# EAGLE design tusb8041_hub_test (EAGLE 6.4)

## Sheet 1 of 6: Board Power
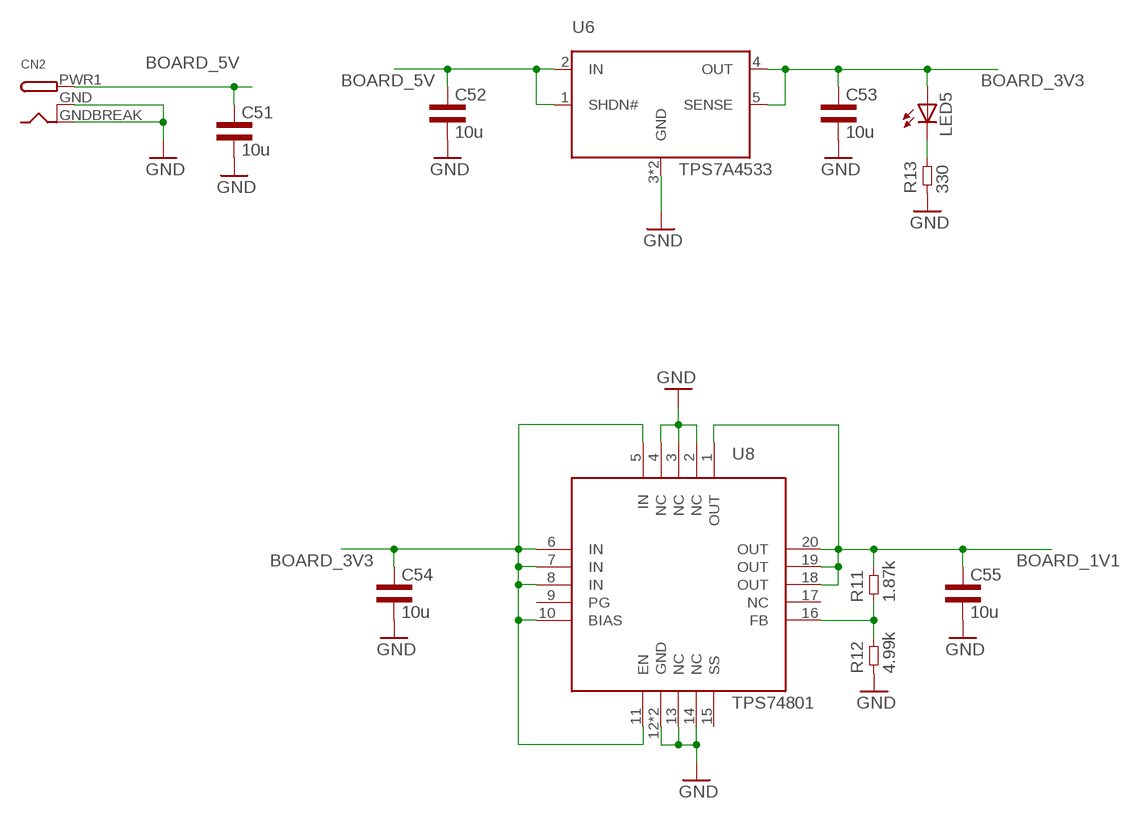
[diagram p0: schematic, sheet 1]

### Parts
C51  10u  CAP1206L3  [1206L3]
C52  10u  CAP1206L3  [1206L3]
C53  10u  CAP1206L3  [1206L3]
C54  10u  CAP1206L3  [1206L3]
C55  10u  CAP1206L3  [1206L3]
CN2  DCBARRELSMT  [DCJACK_2MM_SMT]
LED5  LEDCHIP-LED0603  [CHIP-LED0603]
R11  1.87k  RES0402L3  [0402L3]
R12  4.99k  RES0402L3  [0402L3]
R13  330  RES0603L3  [0603L3]
U6  TPS7A4533  [R-PSFM-G5]
U8  TPS74801  [S-PVQFN-N20]

### Nets
BOARD_1V1: C55.1 R11.P$2 U8.1(OUT) U8.18(OUT) U8.19(OUT) U8.20(OUT) ; also sheet 3
BOARD_3V3: C53.1 C54.1 LED5.A U6.4(OUT) U6.5(SENSE) U8.5(IN) U8.6(IN) U8.7(IN) U8.8(IN) U8.10(BIAS) U8.11(EN) ; also sheet 3
BOARD_5V: C51.1 C52.1 CN2.PWR1(PWR) U6.1(SHDN#) U6.2(IN) ; also sheet 2
GND: C51.2 C52.2 C53.2 C54.2 C55.2 CN2.GND(GNDBREAK) CN2.GNDBREAK(GND) R12.P$1 R13.P$1 U6.3(GND) U6.TP(GND) U8.2(NC) U8.3(NC) U8.4(NC) U8.12(GND) U8.13(NC) U8.14(NC) U8.TP(GND) ; also sheet 2,3,4,5,6
N$13: LED5.C R13.P$2
N$15: R11.P$1 R12.P$2 U8.16(FB)
Unconnected: U8.9(PG) U8.15(SS) U8.17(NC)

## Sheet 2 of 6: Down PWR
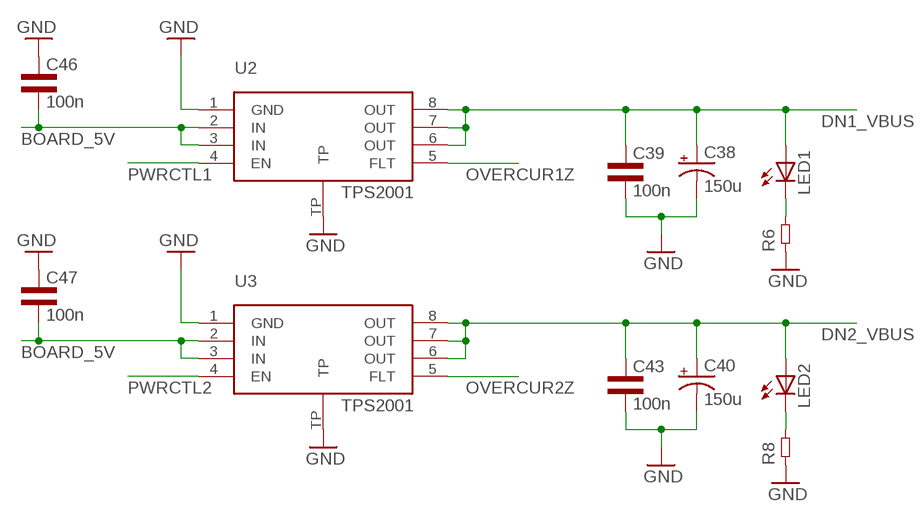
[diagram p1: schematic, sheet 2]

### Parts
C38  150u  CPOL-USCT7343  [CT7343]
C39  100n  CAP0603L3  [0603L3]
C40  150u  CPOL-USCT7343  [CT7343]
C43  100n  CAP0603L3  [0603L3]
C46  100n  CAP0603L3  [0603L3]
C47  100n  CAP0603L3  [0603L3]
LED1  LEDCHIP-LED0603  [CHIP-LED0603]
LED2  LEDCHIP-LED0603  [CHIP-LED0603]
R6  RES0603L3  [0603L3]
R8  RES0603L3  [0603L3]
U2  TPS2001  [S-PDSO-G8]
U3  TPS2001  [S-PDSO-G8]

### Nets
BOARD_5V: C46.P$2 C47.P$2 U2.2(IN) U2.3(IN) U3.2(IN) U3.3(IN) ; also sheet 1
DN1_VBUS: C38.+ C39.P$1 LED1.A U2.6(OUT) U2.7(OUT) U2.8(OUT) ; also sheet 5
DN2_VBUS: C40.+ C43.P$1 LED2.A U3.6(OUT) U3.7(OUT) U3.8(OUT) ; also sheet 5
GND: C38.- C39.P$2 C40.- C43.P$2 C46.P$1 C47.P$1 R6.P$1 R8.P$1 U2.1(GND) U2.TP U3.1(GND) U3.TP ; also sheet 1,3,4,5,6
N$1: LED1.C R6.P$2
N$6: LED2.C R8.P$2
OVERCUR1Z: U2.5(FLT) ; also sheet 5
OVERCUR2Z: U3.5(FLT) ; also sheet 5
PWRCTL1: U2.4(EN) ; also sheet 5
PWRCTL2: U3.4(EN) ; also sheet 5

## Sheet 3 of 6: TUSB PWR
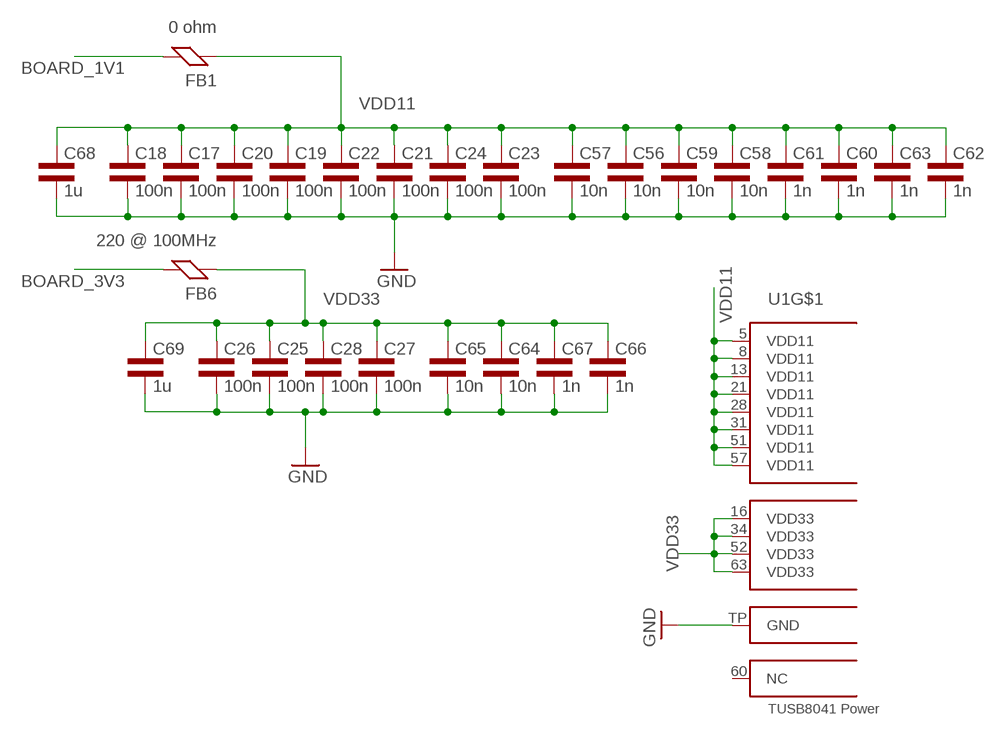
[diagram p2: schematic, sheet 3]

### Parts
C17  100n  CAP0402L3  [0402L3]
C18  100n  CAP0402L3  [0402L3]
C19  100n  CAP0402L3  [0402L3]
C20  100n  CAP0402L3  [0402L3]
C21  100n  CAP0402L3  [0402L3]
C22  100n  CAP0402L3  [0402L3]
C23  100n  CAP0402L3  [0402L3]
C24  100n  CAP0402L3  [0402L3]
C25  100n  CAP0402L3  [0402L3]
C26  100n  CAP0402L3  [0402L3]
C27  100n  CAP0402L3  [0402L3]
C28  100n  CAP0402L3  [0402L3]
C56  10n  CAP0402L3  [0402L3]
C57  10n  CAP0402L3  [0402L3]
C58  10n  CAP0402L3  [0402L3]
C59  10n  CAP0402L3  [0402L3]
C60  1n  CAP0402L3  [0402L3]
C61  1n  CAP0402L3  [0402L3]
C62  1n  CAP0402L3  [0402L3]
C63  1n  CAP0402L3  [0402L3]
C64  10n  CAP0402L3  [0402L3]
C65  10n  CAP0402L3  [0402L3]
C66  1n  CAP0402L3  [0402L3]
C67  1n  CAP0402L3  [0402L3]
C68  1u  CAP0805L3  [0805L3]
C69  1u  CAP0805L3  [0805L3]
FB1  0 ohm  FERRITE0603L3  [0603L3]
FB6  220 @ 100MHz  FERRITE0603L3  [0603L3]
U1  TUSB8041  [VQFN64]

### Nets
BOARD_1V1: FB1.P$2 ; also sheet 1
BOARD_3V3: FB6.P$2 ; also sheet 1
GND: C17.P$2 C18.P$2 C19.P$2 C20.P$2 C21.P$2 C22.P$2 C23.P$2 C24.P$2 C25.P$2 C26.P$2 C27.P$2 C28.P$2 C56.P$2 C57.P$2 C58.P$2 C59.P$2 C60.P$2 C61.P$2 C62.P$2 C63.P$2 C64.P$2 C65.P$2 C66.P$2 C67.P$2 C68.2 C69.2 U1.TP(GND) ; also sheet 1,2,4,5,6
VDD11: C17.P$1 C18.P$1 C19.P$1 C20.P$1 C21.P$1 C22.P$1 C23.P$1 C24.P$1 C56.P$1 C57.P$1 C58.P$1 C59.P$1 C60.P$1 C61.P$1 C62.P$1 C63.P$1 C68.1 FB1.P$1 U1.5(VDD11) U1.8(VDD11) U1.13(VDD11) U1.21(VDD11) U1.28(VDD11) U1.31(VDD11) U1.51(VDD11) U1.57(VDD11)
VDD33: C25.P$1 C26.P$1 C27.P$1 C28.P$1 C64.P$1 C65.P$1 C66.P$1 C67.P$1 C69.1 FB6.P$1 U1.16(VDD33) U1.34(VDD33) U1.52(VDD33) U1.63(VDD33) ; also sheet 5
Unconnected: U1.60(NC)

## Sheet 4 of 6: TUSB US
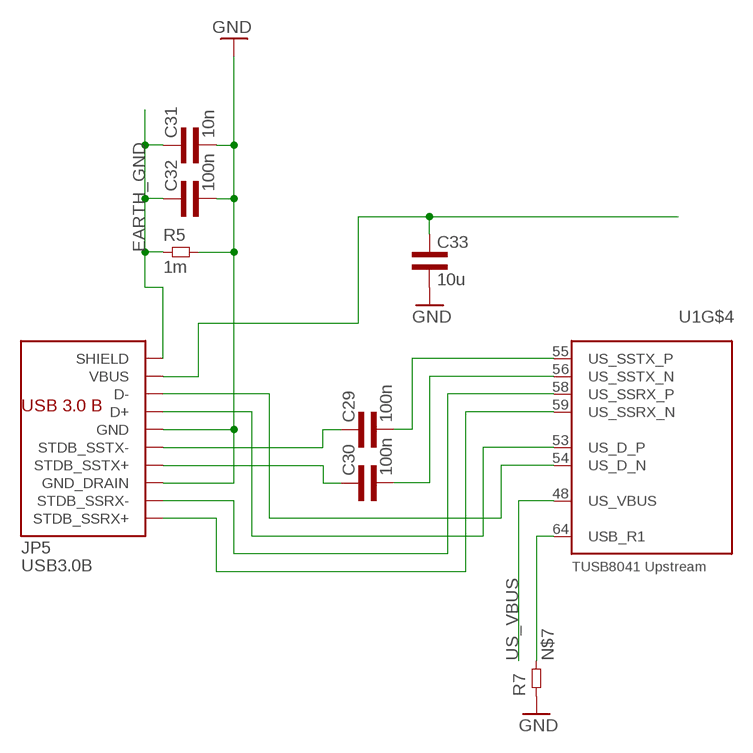
[diagram p3: schematic, sheet 4]

### Parts
C29  100n  CAP0402L3  [0402L3]
C30  100n  CAP0402L3  [0402L3]
C31  10n  CAP0603L3  [0603L3]
C32  100n  CAP0603L3  [0603L3]
C33  10u  CAP1206L3  [1206L3]
JP5  USB3.0B  [AMPHENOLUSB3.0B]
R5  1m  RES0603L3  [0603L3]
R7  RES0402L3  [0402L3]

### Nets
EARTH_GND: C31.P$1 C32.P$1 JP5.10@1(SHIELD) JP5.10@2(SHIELD) R5.P$1 ; also sheet 5
GND: C31.P$2 C32.P$2 C33.2 JP5.4(GND) JP5.7(GND_DRAIN) R5.P$2 R7.P$1 ; also sheet 1,2,3,5,6
N$7: R7.P$2 U1.64(USB_R1)
US_CAP_SSTX_N: C29.P$1 JP5.5(STDB_SSTX-)
US_CAP_SSTX_P: C30.P$1 JP5.6(STDB_SSTX+)
US_D_N: JP5.2(D-) U1.54(US_D_N)
US_D_P: JP5.3(D+) U1.53(US_D_P)
US_SSRX_N: JP5.9(STDB_SSRX+) U1.59(US_SSRX_N)
US_SSRX_P: JP5.8(STDB_SSRX-) U1.58(US_SSRX_P)
US_SSTX_N: C30.P$2 U1.56(US_SSTX_N)
US_SSTX_P: C29.P$2 U1.55(US_SSTX_P)
US_VBUS: C33.1 JP5.1(VBUS) U1.48(US_VBUS)

## Sheet 5 of 6: TUSB DS
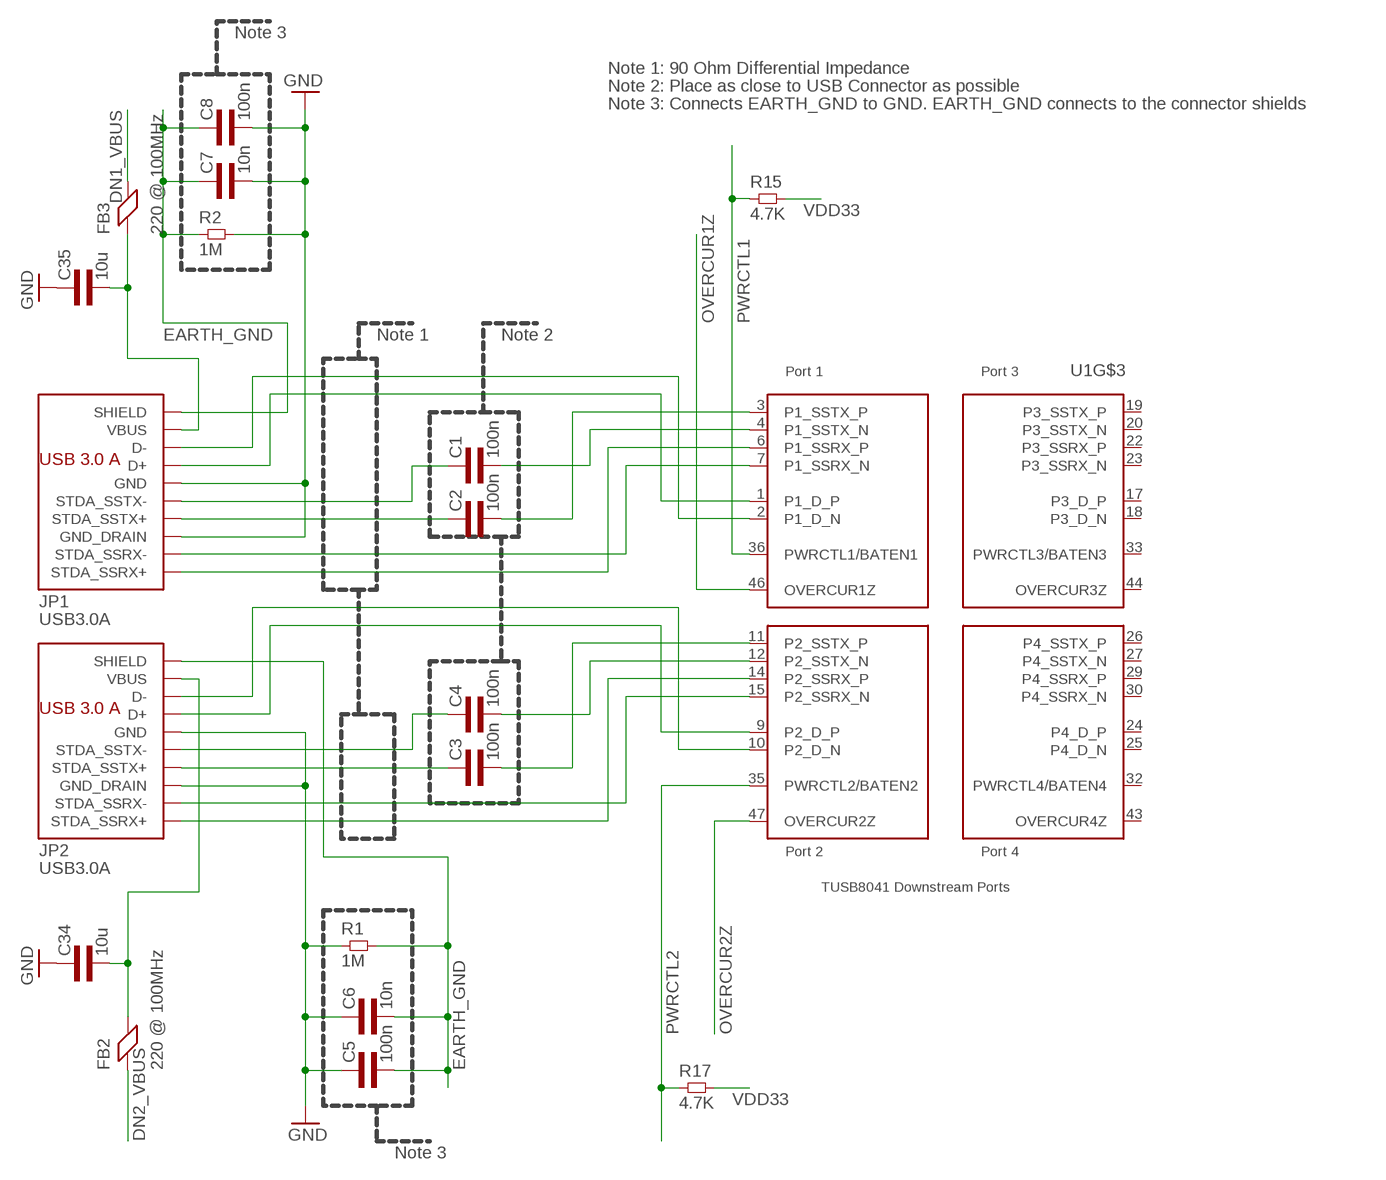
[diagram p4: schematic, sheet 5]

### Parts
C1  100n  CAP0402L3  [0402L3]
C2  100n  CAP0402L3  [0402L3]
C3  100n  CAP0402L3  [0402L3]
C4  100n  CAP0402L3  [0402L3]
C5  100n  CAP0603L3  [0603L3]
C6  10n  CAP0603L3  [0603L3]
C7  10n  CAP0603L3  [0603L3]
C8  100n  CAP0603L3  [0603L3]
C34  10u  CAP1206L3  [1206L3]
C35  10u  CAP1206L3  [1206L3]
FB2  220 @ 100MHz  FERRITE0603L1  [0603L1]
FB3  220 @ 100MHz  FERRITE0603L1  [0603L1]
JP1  USB3.0A  [AMPHENOLUSB3.0A]
JP2  USB3.0A  [AMPHENOLUSB3.0A]
R1  1M  RES0603L3  [0603L3]
R2  1M  RES0603L3  [0603L3]
R15  4.7K  RES0402L3  [0402L3]
R17  4.7K  RES0402L3  [0402L3]

### Nets
DN1_VBUS: FB3.2 ; also sheet 2
DN2_VBUS: FB2.1 ; also sheet 2
EARTH_GND: C5.P$2 C6.P$2 C7.P$1 C8.P$1 JP1.10@1(SHIELD) JP1.10@2(SHIELD) JP2.10@1(SHIELD) JP2.10@2(SHIELD) R1.P$2 R2.P$1 ; also sheet 4
GND: C5.P$1 C6.P$1 C7.P$2 C8.P$2 C34.1 C35.1 JP1.4(GND) JP1.7(GND_DRAIN) JP2.4(GND) JP2.7(GND_DRAIN) R1.P$1 R2.P$2 ; also sheet 1,2,3,4,6
N$2: C35.2 FB3.1 JP1.1(VBUS)
N$3: C34.2 FB2.2 JP2.1(VBUS)
OVERCUR1Z: U1.46(OVERCUR1Z) ; also sheet 2
OVERCUR2Z: U1.47(OVERCUR2Z) ; also sheet 2
P1_CAP_SSTX_N: C1.P$1 JP1.8(STDA_SSTX-)
P1_CAP_SSTX_P: C2.P$1 JP1.9(STDA_SSTX+)
P1_D_N: JP1.2(D-) U1.2(P1_D_N)
P1_D_P: JP1.3(D+) U1.1(P1_D_P)
P1_SSRX_N: JP1.5(STDA_SSRX-) U1.7(P1_SSRX_N)
P1_SSRX_P: JP1.6(STDA_SSRX+) U1.6(P1_SSRX_P)
P1_SSTX_N: C1.P$2 U1.4(P1_SSTX_N)
P1_SSTX_P: C2.P$2 U1.3(P1_SSTX_P)
P2_CAP_SSTX_N: C4.P$1 JP2.8(STDA_SSTX-)
P2_CAP_SSTX_P: C3.P$1 JP2.9(STDA_SSTX+)
P2_D_N: JP2.2(D-) U1.10(P2_D_N)
P2_D_P: JP2.3(D+) U1.9(P2_D_P)
P2_SSRX_N: JP2.5(STDA_SSRX-) U1.15(P2_SSRX_N)
P2_SSRX_P: JP2.6(STDA_SSRX+) U1.14(P2_SSRX_P)
P2_SSTX_N: C4.P$2 U1.12(P2_SSTX_N)
P2_SSTX_P: C3.P$2 U1.11(P2_SSTX_P)
PWRCTL1: R15.P$1 U1.36(PWRCTL1/BATEN1) ; also sheet 2
PWRCTL2: R17.P$1 U1.35(PWRCTL2/BATEN2) ; also sheet 2
VDD33: R15.P$2 R17.P$2 ; also sheet 3
Unconnected: U1.17(P3_D_P) U1.18(P3_D_N) U1.19(P3_SSTX_P) U1.20(P3_SSTX_N) U1.22(P3_SSRX_P) U1.23(P3_SSRX_N) U1.24(P4_D_P) U1.25(P4_D_N) U1.26(P4_SSTX_P) U1.27(P4_SSTX_N) U1.29(P4_SSRX_P) U1.30(P4_SSRX_N) U1.32(PWRCTL4/BATEN4) U1.33(PWRCTL3/BATEN3) U1.43(OVERCUR4Z) U1.44(OVERCUR3Z)

### Notes on the sheet
- Note 3
- Note 1: 90 Ohm Differential Impedance
- Note 2: Place as close to USB Connector as possible
- Note 3: Connects EARTH_GND to GND. EARTH_GND connects to the connector shields
- Note 1 | Note 2
- Note 3

## Sheet 6 of 6: TUSB Misc
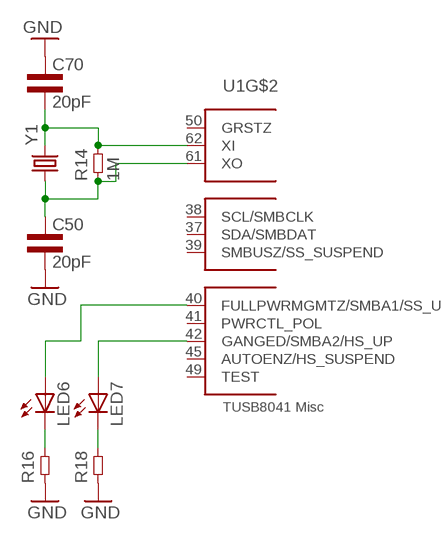
[diagram p5: schematic, sheet 6]

### Parts
C50  20pF  CAP0402L3  [0402L3]
C70  20pF  CAP0402L3  [0402L3]
LED6  LEDCHIPLED_0603  [CHIPLED_0603]
LED7  LEDCHIPLED_0603  [CHIPLED_0603]
R14  1M  RES0402L3  [0402L3]
R16  RES0402L3  [0402L3]
R18  RES0402L3  [0402L3]
Y1  CRYSTALHC49US  [HC49US]

### Nets
CLK_N: C70.P$2 R14.P$2 U1.62(XI) Y1.2
CLK_P: C50.P$1 R14.P$1 U1.61(XO) Y1.1
GND: C50.P$2 C70.P$1 R16.P$1 R18.P$1 ; also sheet 1,2,3,4,5
N$10: LED6.C R16.P$2
N$11: LED7.C R18.P$2
N$12: LED7.A U1.42(GANGED/SMBA2/HS_UP)
N$14: LED6.A U1.40(FULLPWRMGMTZ/SMBA1/SS_UP)
Unconnected: U1.37(SDA/SMBDAT) U1.38(SCL/SMBCLK) U1.39(SMBUSZ/SS_SUSPEND) U1.41(PWRCTL_POL) U1.45(AUTOENZ/HS_SUSPEND) U1.49(TEST) U1.50(GRSTZ)

## Library data of the parts
C1-C8 C17-C35 C39 C43 C46 C47 C50-C70 = common:CAP
C38 C40 = rcl:CPOL-US: POLARIZED CAPACITOR, American symbol
CN2 = adafruit:DCBARREL: 2.0mm DC Barrel Jack DCJACK_2MM_PTH - Through Hole Jack (4UConnector: 05537)
FB1-FB3 FB6 = common:FERRITE
JP1 JP2 = AlexW-Eagle-Libraries:USB3.0A: Usb3.0A Amphenol USB 3.0 A jack
JP5 = AlexW-Eagle-Libraries:USB3.0B: USB3.0B Amphenol USB 3.0 B connector
LED1 LED2 LED5-LED7 = adafruit:LED: LED OSRAM: - CHIPLED LG R971, LG N971, LY N971, LG Q971, LY Q971, LO R971, LY R971 LH N974, LH R974 LS Q976, LO Q976, LY Q976 LO Q996 - Hyper CHIPLED LW Q18S LB Q993, LB Q99A, LB R99A - SideLED LS A670, LO A670, LY A670, LG A670, LP A670 LB A673, LV A673, LT A673, LW A673 LH A674 LY A675 LS A676, LA A676, LO A676, LY A676, LW A676 LS A679, LY A679, LG A679 - Hyper Micro SIDELED® LS Y876, LA Y876, LO Y876, LY Y876 LT Y87S - SmartLED LW L88C, LW L88S LB L89C, LB L89S, LG L890 LS L89K, LO L89K, LY L89K LS L896, LA L896, LO L896, LY L896 - TOPLED LS T670, LO T670, LY T670, LG T670, LP T670 LSG T670, LSP T670, LSY T670, LOP T670, LYG T670 LG T671, LOG T671, LSG T671 LB T673, LV T673, LT T673, LW T673 LH T674 LS T676, LA T676, LO T676, LY T676, LB T676, LH T676, LSB T676, LW T676 LB T67C, LV T67C, LT T67C, LS T67K, LO T67K, LY T67K, LW E67C LS E67B, LA E67B, LO E67B, LY E67B, LB E67C, LV E67C, LT E67C LW T67C LS T679, LY T679, LG T679 LS T770, LO T770, LY T770, LG T770, LP T770 LB T773, LV T773, LT T773, LW T773 LH T774 LS E675, LA E675, LY E675, LS T675 LS T776, LA T776, LO T776, LY T776, LB T776 LHGB T686 LT T68C, LB T68C - Hyper Mini TOPLED® LB M676 - Mini TOPLED Santana® LG M470 LS M47K, LO M47K, LY M47K Source: http://www.osram.convergy.de/
R1 R2 R5-R8 R11-R18 = common:RES
U1 = ti_usb:TUSB8041
U2 U3 = ti_ldo:TPS2001
U6 = ti_ldo:TPS7A4533
U8 = ti_ldo:TPS74801
Y1 = SparkFun-FreqCtrl:CRYSTAL: Various standard crystals. Proven footprints. Spark Fun Electronics SKU : COM-00534

## Board
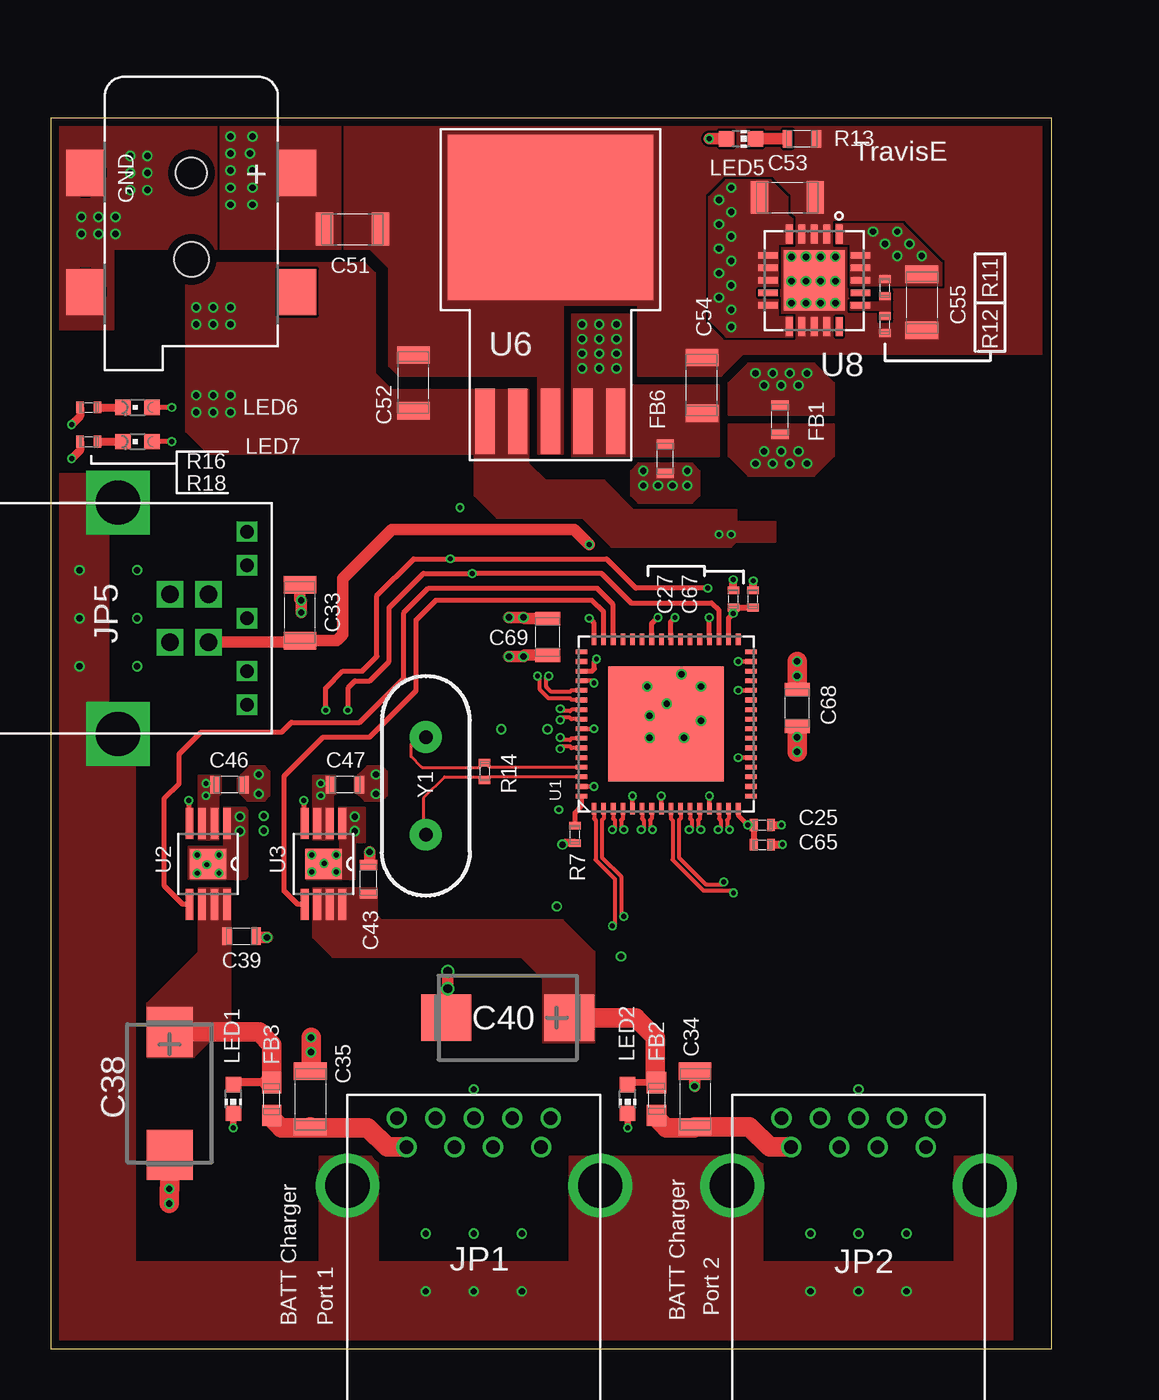
[diagram p6: board, top side]
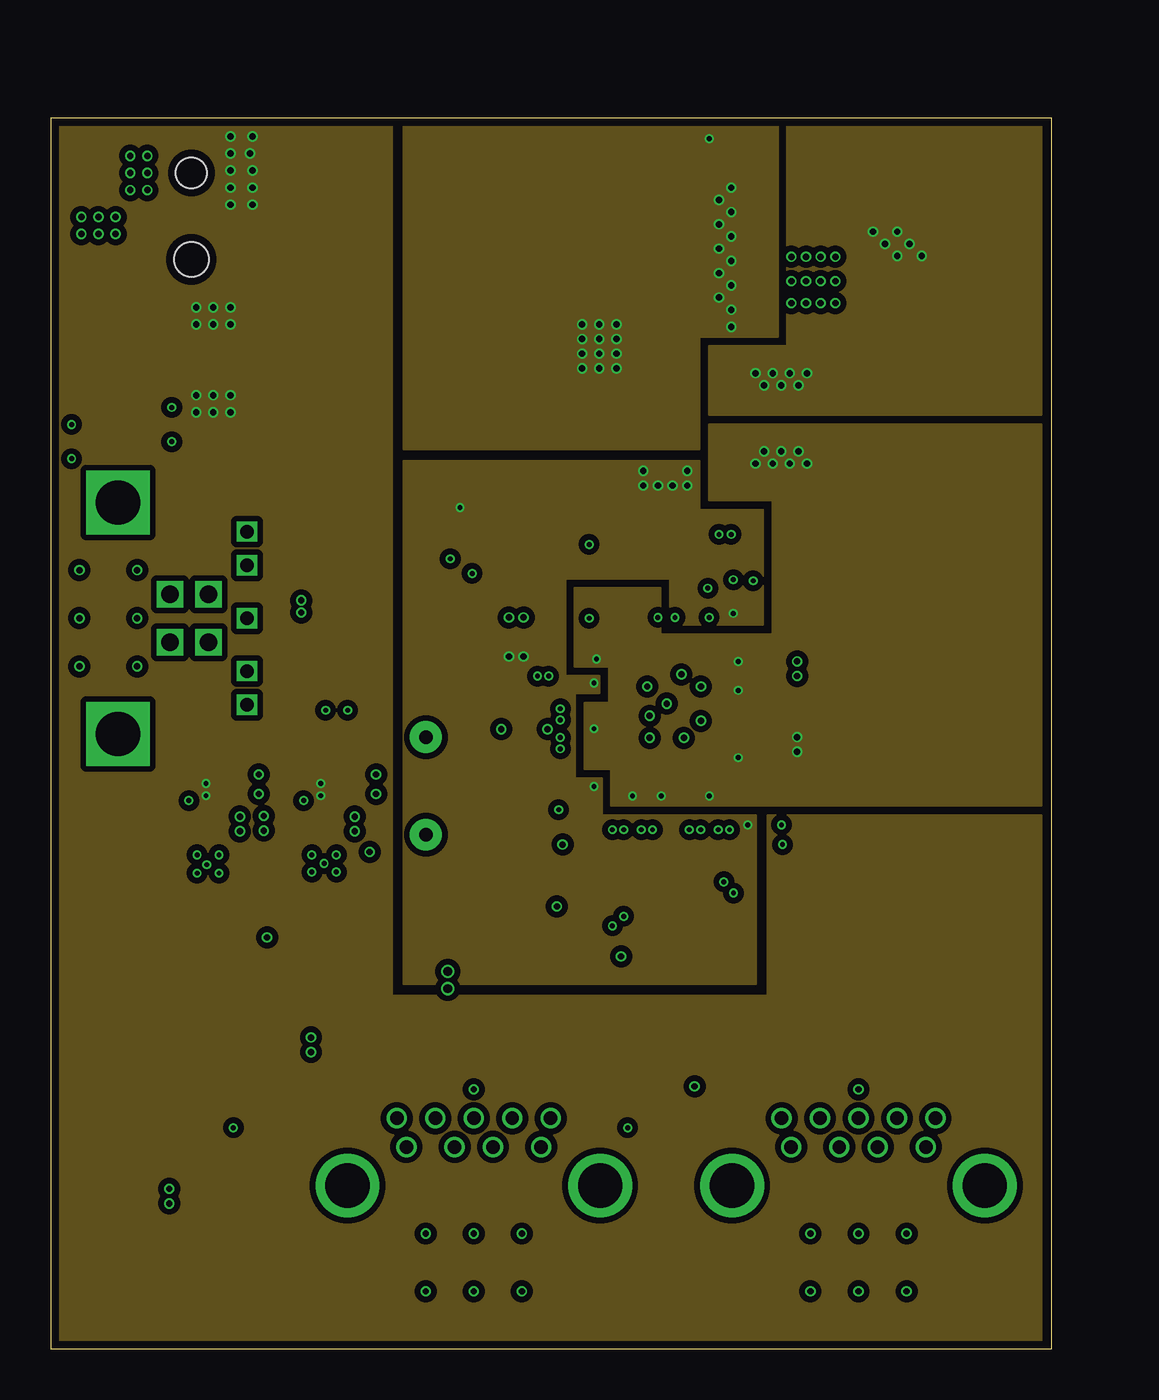
[diagram p7: board, inner layer Route2]
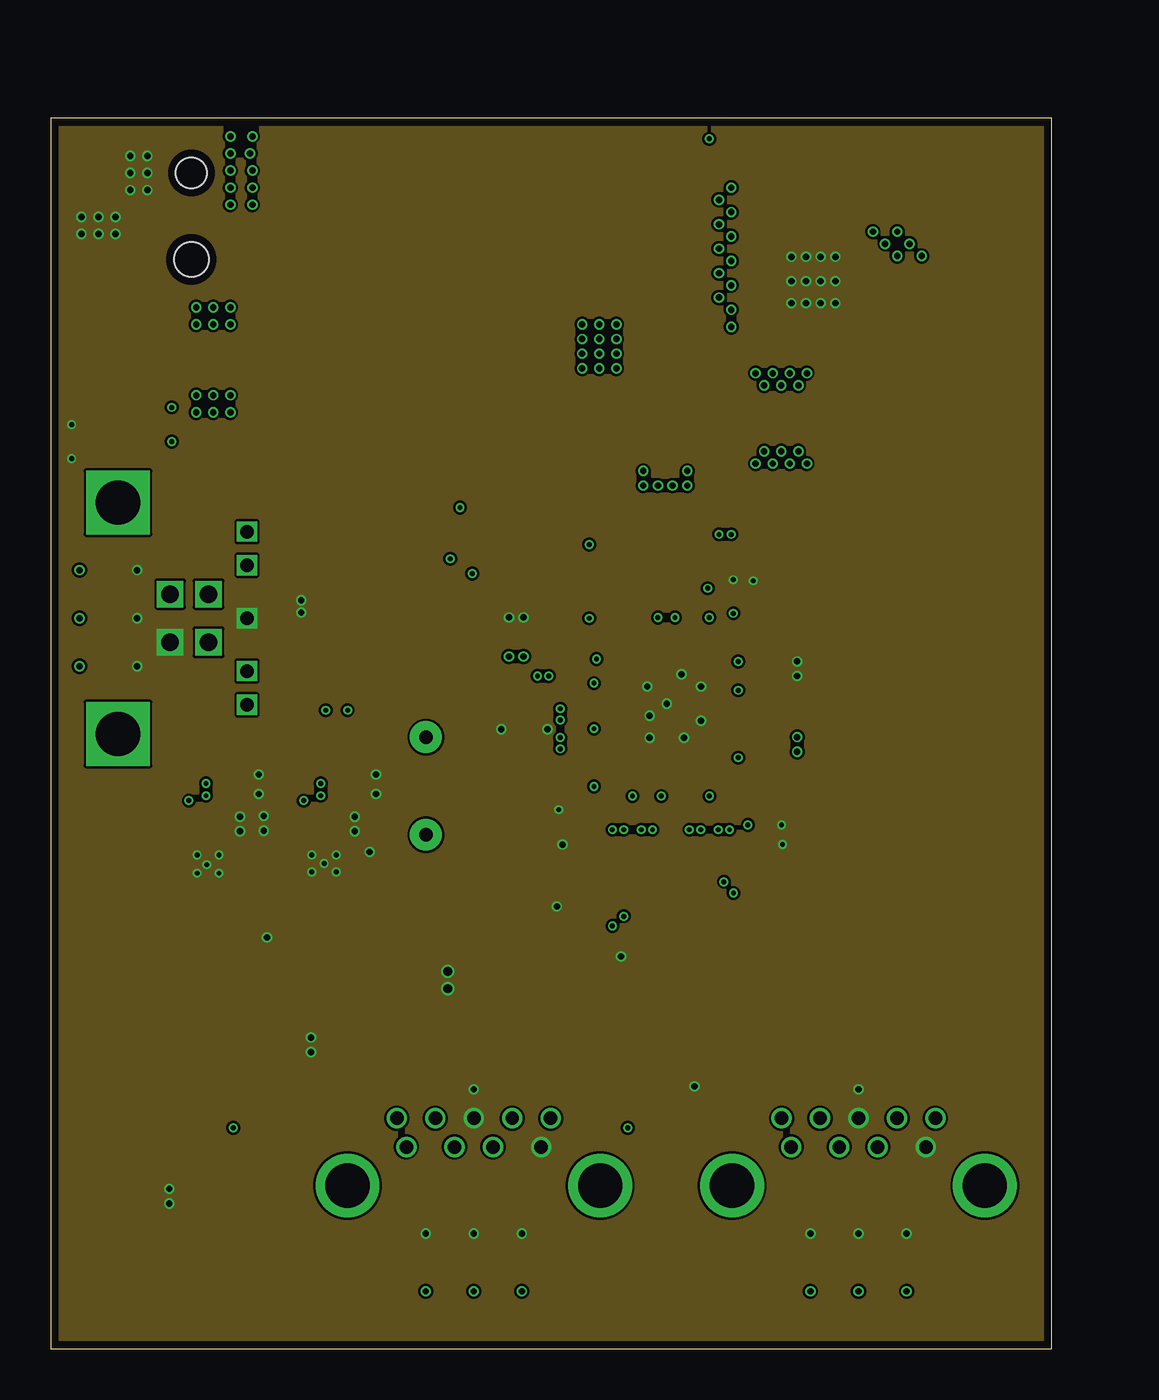
[diagram p8: board, inner layer Route3]
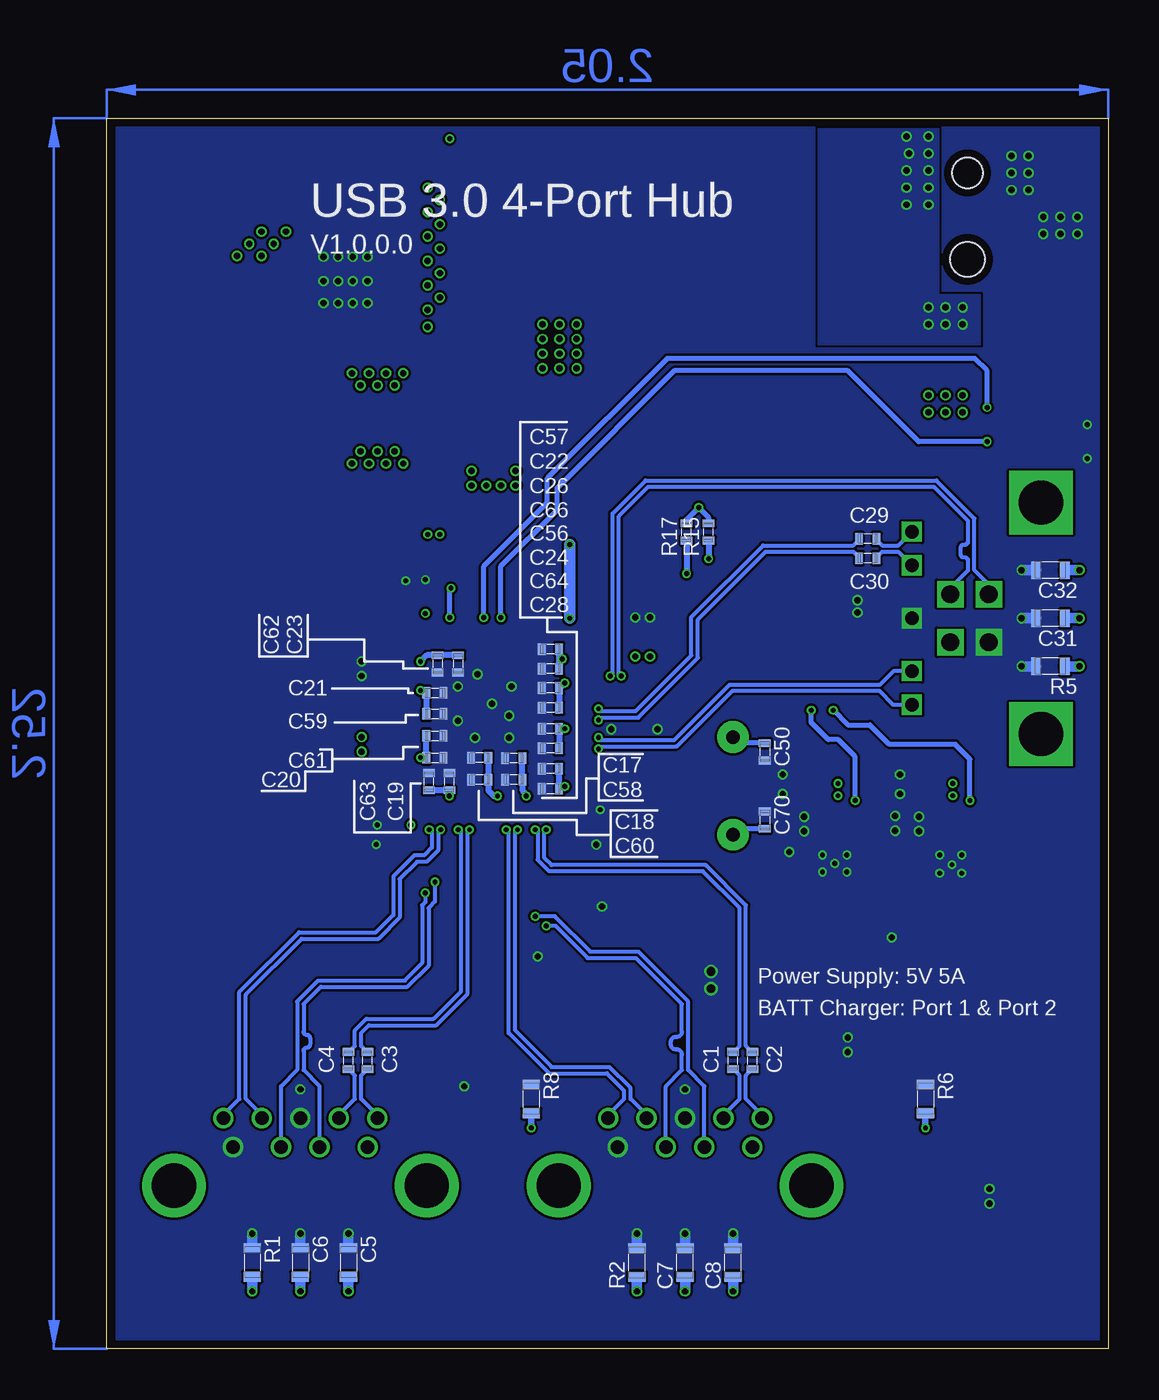
[diagram p9: board, bottom side, seen from below]

Size 52.05 x 64 mm. Coordinates in mm from the lower left corner, seen from the top.
Outline: 0,0 52.05,0 52.05,64 0,64 0,0
Copper layers (1*2*3*16): Top 0.035mm / dielectric 1.5mm / Route2 0.035mm / dielectric 0.15mm / Route3 0.035mm / dielectric 0.2mm / Bottom 0.035mm
Design rules "default *": minimum track width 4mil, minimum drill 10mil, track to track 5mil, track to pad 5mil, pad to pad 5mil, via to via 5mil, smd to smd 5mil, copper to edge 16mil, drill to drill 5mil, minimum pad ring 4mil, minimum via ring 4mil, stop-mask expansion 4mil, vias tented up to drill 16mil, thermal gap 10mil

### Footprints (pad centres in the part's own frame; a part is rotated, then mirrored left to right if it is on the bottom)
0402L3 = smd 0.4 x 0.6: P$1 -0.45,0; P$2 0.45,0
0603L3 = smd 0.5 x 0.9: P$1 -0.75,0; P$2 0.75,0
1206L3 = smd 0.9 x 1.7: 1 -1.45,0; 2 1.45,0
CT7343 = smd 2.6 x 2.4: + -3.2,0; - 3.2,0
0805L3 = smd 0.7 x 1.3: 1 -0.95,0; 2 0.95,0
DCJACK_2MM_SMT = smd 2.4 x 2: GND 0,-5.5; GNDBREAK 6.2,-5.5; PWR1 0,5.5; PWR2 6.2,5.5 | hole 1.6: 0,0 | hole 1.8: 4.5,0
0603L1 = smd 1.1 x 1: 1 -0.85,0; 2 0.85,0
AMPHENOLUSB3.0A = drill 0.7: 1 -3.5,2; 2 -1,2; 3 1,2; 4 3.5,2; 5 4,3.5; 6 2,3.5; 7 0,3.5; 8 -2,3.5; 9 -4,3.5 | drill 2.3: 10@1 -6.57,0; 10@2 6.57,0
AMPHENOLUSB3.0B = drill 0.92 square: 1 1.25,4.71; 2 -1.25,4.71; 3 -1.25,2.71; 4 1.25,2.71 | drill 0.7 square: 5 -4.5,6.71; 6 -2.75,6.71; 7 0,6.71; 8 2.75,6.71; 9 4.5,6.71 | drill 2.3 square: 10@1 -6.02,0; 10@2 6.02,0
CHIP-LED0603 = smd 0.8 x 0.8: A 0,-0.75; C 0,0.75
CHIPLED_0603 = smd 0.8 x 0.8: A 0,-0.75; C 0,0.75
VQFN64 = smd 0.6 x 0.24: 1 -4.4,3.75; 2 -4.4,3.25; 3 -4.4,2.75; 4 -4.4,2.25; 5 -4.4,1.75; 6 -4.4,1.25; 7 -4.4,0.75; 8 -4.4,0.25; 9 -4.4,-0.25; 10 -4.4,-0.75; 11 -4.4,-1.25; 12 -4.4,-1.75; 13 -4.4,-2.25; 14 -4.4,-2.75; 15 -4.4,-3.25; 16 -4.4,-3.75; 33 4.4,-3.75; 34 4.4,-3.25; 35 4.4,-2.75; 36 4.4,-2.25; 37 4.4,-1.75; 38 4.4,-1.25; 39 4.4,-0.75; 40 4.4,-0.25; 41 4.4,0.25; 42 4.4,0.75; 43 4.4,1.25; 44 4.4,1.75; 45 4.4,2.25; 46 4.4,2.75; 47 4.4,3.25; 48 4.4,3.75 | smd 0.24 x 0.6: 17 -3.75,-4.4; 18 -3.25,-4.4; 19 -2.75,-4.4; 20 -2.25,-4.4; 21 -1.75,-4.4; 22 -1.25,-4.4; 23 -0.75,-4.4; 24 -0.25,-4.4; 25 0.25,-4.4; 26 0.75,-4.4; 27 1.25,-4.4; 28 1.75,-4.4; 29 2.25,-4.4; 30 2.75,-4.4; 31 3.25,-4.4; 32 3.75,-4.4; 49 3.75,4.4; 50 3.25,4.4; 51 2.75,4.4; 52 2.25,4.4; 53 1.75,4.4; 54 1.25,4.4; 55 0.75,4.4; 56 0.25,4.4; 57 -0.25,4.4; 58 -0.75,4.4; 59 -1.25,4.4; 60 -1.75,4.4; 61 -2.25,4.4; 62 -2.75,4.4; 63 -3.25,4.4; 64 -3.75,4.4 | smd 6 x 6: TP 0,0
S-PDSO-G8 = smd 0.4 x 1.6: 1 -0.975,-2.1; 2 -0.325,-2.1; 3 0.325,-2.1; 4 0.975,-2.1; 5 0.975,2.1; 6 0.325,2.1; 7 -0.325,2.1; 8 -0.975,2.1 | smd 1.89 x 1.57: TP 0,0
R-PSFM-G5 = smd 1 x 3.4: 1 -3.4,-5.3; 2 -1.7,-5.3; 3 0,-5.3; 4 1.7,-5.3; 5 3.4,-5.3 | smd 10.7 x 8.6: TP 0,5.3
S-PVQFN-N20 = smd 0.35 x 1: 1 -1.3,-2.4; 2 -0.65,-2.4; 3 0,-2.4; 4 0.65,-2.4; 5 1.3,-2.4; 11 1.3,2.4; 12 0.65,2.4; 13 0,2.4; 14 -0.65,2.4; 15 -1.3,2.4 | smd 1 x 0.35: 6 2.4,-1.3; 7 2.4,-0.65; 8 2.4,0; 9 2.4,0.65; 10 2.4,1.3; 16 -2.4,1.3; 17 -2.4,0.65; 18 -2.4,0; 19 -2.4,-0.65; 20 -2.4,-1.3 | smd 3.15 x 3.15: TP 0,0
HC49US = drill 0.7 pad 1.651: 1 -2.54,0; 2 2.54,0

### Placement (x,y rotation side)
C1  19.5,15 90 bottom
C2  18.5,15 90 bottom
C3  38.5,15 90 bottom
C4  39.5,15 90 bottom
C5  39.5,4.5 270 bottom
C6  42,4.5 270 bottom
C7  22,4.5 90 bottom
C8  19.5,4.5 90 bottom
C17  30.91,30.73 180 bottom
C18  32.68,30.75 180 bottom
C19  34.25,29.5 90 bottom
C20  35,30.75 0 bottom
C21  35,34.12 0 bottom
C22  29,35.38 180 bottom
C23  33.8,35.63 270 bottom
C24  29,31.23 180 bottom
C25  37,27.25 0 top
C26  29,34.37 180 bottom
C27  35.5,39 90 top
C28  29,29.12 180 bottom
C29  12.5,42.12 180 bottom
C30  12.5,41.12 180 bottom
C31  3,38 180 bottom
C32  3,40.5 180 bottom
C33  12.96,38.28 90 top
C34  33.5,13 270 top
C35  13.5,13 270 top
C38  6.19,13.29 270 top
C39  9.92,21.46 0 top
C40  23.76,17.23 180 top
C43  16.53,24.42 90 top
C46  9.3,29.35 180 top
C47  15.3,29.35 180 top
C50  17.86,31.06 270 bottom
C51  15.7,58.23 0 top
C52  18.87,50.23 90 top
C53  38.3,59.89 0 top
C54  33.86,50.11 90 top
C55  45.29,54.42 270 top
C56  29,32.26 180 bottom
C57  29,36.39 180 bottom
C58  30.91,29.6 180 bottom
C59  35,33.02 0 bottom
C60  32.68,29.6 180 bottom
C61  35,31.88 0 bottom
C62  34.87,35.63 270 bottom
C63  35.32,29.5 90 bottom
C64  29,30.17 180 bottom
C65  37,26.23 0 top
C66  29,33.34 180 bottom
C67  36.53,39 90 top
C68  38.81,33.34 90 top
C69  25.86,37.03 90 top
C70  17.86,27.5 270 bottom
CN2  7.31,61.16 270 top
FB1  37.92,48.33 90 top
FB2  31.5,13 270 top
FB3  11.5,13 90 top
FB6  31.95,46.3 90 top
JP1  22,8.5 0 top
JP2  42,8.5 0 top
JP5  3.5,38 270 top
LED1  9.5,13 180 top
LED2  30,13 180 top
LED5  35.89,62.93 270 top
LED6  4.52,48.96 90 top
LED7  4.52,47.19 90 top
R1  44.5,4.5 270 bottom
R2  24.5,4.5 90 bottom
R5  3,35.5 180 bottom
R6  9.5,13 270 bottom
R7  27.27,26.75 90 top
R8  30,13 270 bottom
R11  43.38,55.19 90 top
R12  43.38,53.28 90 top
R13  39.06,62.93 180 top
R14  22.56,30.04 270 top
R15  20.78,42.49 90 bottom
R16  1.98,48.96 0 top
R17  21.92,42.49 90 bottom
R18  1.98,47.19 0 top
U1  32,32.5 90 top
U2  8.19,25.22 180 top
U3  14.19,25.22 180 top
U6  25.98,53.53 0 top
U8  39.7,55.57 180 top
Y1  19.51,29.28 270 top

### Tracks (layer width: path | path; a pad name or v marks a point on that pad's centre or on a via)
BOARD_1V1  (via drill 0.33)
  other vias: 44.02,58.11 44.65,57.47 45.29,56.84 43.38,57.47 44.02,56.84 42.75,58.11 36.65,50.74 37.54,50.74 38.43,50.74 39.32,50.74 37.1,50.11 37.99,50.11 38.87,50.11
  pour Top (no thermals): 40.84,58.49 44.27,58.49 46.3,56.46 46.3,55.31 41.6,55.31 41.6,57.47 40.84,57.47
  pour Route2 (isolate 0.305, no thermals): 51.51,63.57 38.3,63.57 38.3,52.14 34.24,52.14 34.24,48.58 51.51,48.58
  pour Top (no thermals): 35.25,48.58 35.25,50.23 36.27,51.25 39.7,51.25 40.72,50.23 40.72,48.58
BOARD_3V3  (via drill 0.25, 0.33)
  Top 0.61: LED5.A v34.24,62.93
  other vias: 27.64,53.28 28.52,53.28 29.41,53.28 27.64,52.52 28.52,52.52 29.41,52.52 27.64,51.76 28.52,51.76 29.41,51.76 27.64,51 28.52,51 29.41,51 34.75,59.76 35.38,60.39 35.38,59.12 34.75,58.49 35.38,57.85 34.75,57.22 35.38,56.58 34.75,55.95 35.38,55.31 34.75,54.68 35.38,54.04 35.38,53.15
  pour Top (no thermals): 27.13,46.55 27.13,53.79 29.92,53.79 30.05,53.79 30.05,50.11 34.75,50.11 34.75,46.55 34.75,46.42 27.13,46.42
  pour Top (no thermals): 38.56,57.47 38.56,58.74 38.3,59 38.3,59.89 37.41,60.77 35.13,60.77 34.24,59.89 34.24,53.53 35.13,52.65 37.79,52.65 37.79,57.47
  pour Top (no thermals): 38.56,53.66 37.79,53.66 37.79,54.42 36.78,54.42 36.78,52.65 38.56,52.65
  pour Route2 (isolate 0.305, no thermals): 18.36,46.8 33.73,46.8 33.73,52.65 37.79,52.65 37.79,63.57 18.36,63.57
BOARD_5V  (via drill 0.25, 0.33)
  other vias: 8.08,29.41 8.08,28.77 14.05,29.41 14.05,28.77 34.75,42.36 35.38,42.36 7.57,49.6 8.46,49.6 9.35,49.6 7.57,48.71 8.46,48.71 9.35,48.71 7.57,54.17 8.46,54.17 9.35,54.17 7.57,53.28 8.46,53.28 9.35,53.28 9.35,63.06 10.49,63.06 9.35,62.17 10.36,62.17 9.35,61.28 9.35,60.39 9.35,59.5 10.49,61.28 10.49,60.39 10.49,59.5
  pour Top (no thermals): 7.7,26.48 7.7,29.79 8.84,29.79 8.84,28.9 8.71,28.77 8.71,26.48
  pour Top (no thermals): 13.67,26.48 13.67,29.79 14.81,29.79 14.81,28.9 14.68,28.77 14.68,26.48
  pour Top (no thermals): 37.67,41.98 34.37,41.98 34.37,43.12 35.25,43.12 35.38,42.99 37.67,42.99
  pour Top (no thermals): 7.06,50.23 7.06,55.31 8.2,56.46 16.33,56.46 16.84,55.95 16.84,50.74 17.73,49.85 24.84,49.85 24.84,46.55 8.2,46.55 7.06,47.69
  pour Route2 (isolate 0.305, no thermals): 17.73,63.57 0.46,63.57 0.46,0.45 51.51,0.45 51.51,27.75 37.29,27.75 37.29,18.36 17.73,18.36
  pour Top (no thermals): 22.05,49.85 22.05,44.39 23.19,43.25 27.64,43.25 29.16,41.72 35.38,41.72 35.64,41.98 35.64,43.63 30.3,43.63 28.78,45.15 25.73,45.15 24.84,46.04 24.84,49.85
  pour Bottom: 11,63.44 8.84,63.44 8.84,54.81 6.68,54.81 6.68,52.27 15.06,52.27 15.06,63.44
  pour Top (no thermals): 8.84,63.57 15.06,63.57 15.06,57.22 8.84,57.22
CLK_N
  Top 0.152: Y1.2 19.38,26.87 19.38,28.64 20.49,29.75 22.39,29.75 R14.P$2 22.72,29.75 U1.62
  Bottom 0.254: C70.P$2 19.19,27.05 Y1.2
CLK_P
  Top 0.152: Y1.1 19.13,31.82 18.75,31.44 18.75,30.8 19.3,30.25 22.31,30.25 R14.P$1 22.8,30.25 U1.61
  Bottom 0.254: C50.P$1 19.19,31.51 Y1.1
DN1_VBUS
  Top 0.406: FB3.2 11.38,13.85 9.6,13.85 LED1.A
  Top 1.016: C38.+ 10.84,16.49 11.51,15.82 11.51,13.98 11.38,13.85
  pour Top (no thermals): 9.35,23.94 9.35,17.09 7.44,15.18 5.03,15.18 5.03,17.98 7.7,20.64 7.7,23.94
DN2_VBUS
  Top 0.33: FB2.1 30.1,13.85 LED2.A
  Top 1.016: C40.+ 30.41,17.23 31.44,16.2 31.44,13.91 FB2.1
  pour Top (no thermals): 25.6,15.94 25.6,19.24 24.46,20.39 14.68,20.39 13.67,21.4 13.67,23.94 16.97,23.94 16.97,22.55 17.22,22.29 26.62,22.29 28.27,20.64 28.27,15.94
EARTH_GND  (via drill 0.33)
  Bottom 0.533: R1.P$2 v44.5,3 | C6.P$2 v42,3 | C5.P$2 v39.5,3 | R2.P$1 v24.5,3 | C7.P$1 v22,3 | C8.P$1 v19.5,3 | R5.P$1 v1.5,35.5 | C31.P$1 v1.5,38 | C32.P$1 v1.5,40.5
  pour Top (isolate 0.406, no thermals): 5,45.5 0.5,45.5 0.5,0.5 50,0.5 50,10 47,10 47,4.5 37,4.5 37,10 27,10 27,4.5 17,4.5 17,10 14,10 14,4.5 4.37,4.5 4.37,30.5 5,30.5 5,33.5 3,33.5 3,42.5 5,42.5
GND  (via drill 0.25, 0.33, 0.46)
  Top 0.127: C39.P$2 10.69,21.46 10.74,21.4 | C43.P$2 16.53,25.28 16.59,25.34 | C34.1 33.5,14.19 33.48,14.16 | C68.2 38.81,34.48
  Top 0.305: U1.TP 32,31.81 32.03,31.78 v31.14,31.78
  Top 0.406: C27.P$2 v35.5,40 | C25.P$2 v38,27.25 | R7.P$1 26.69,26.3 v26.62,26.23 | C65.P$2 v38.05,26.23 | C67.P$2 v36.53,39.95 | R16.P$1 1.53,48.51 v1.09,48.07 | R18.P$1 1.53,46.73 v1.09,46.3
  Top 0.61: C69.2 24.65,37.97 v24.59,38.04 v23.83,38.04 | C40.- 20.56,18.65 v20.65,18.74 v20.65,19.63 | C33.2 12.96,39 v13.03,38.93 v13.03,38.3 | 10.74,21.4 v11.25,21.4 | 16.59,25.34 v16.59,25.85 | C35.1 13.5,14.63 13.54,14.67 | 33.48,14.16 v33.48,13.66
  Top 1.016: C38.- 6.19,8.34 v6.17,8.32 v6.17,7.56 | 13.54,14.67 v13.54,15.44 v13.54,16.2 | 38.81,34.48 v38.81,34.99 v38.81,35.75
  Bottom 0.533: R1.P$1 v44.5,6 | C6.P$1 v42,6 | C5.P$1 v39.5,6 | R2.P$2 v24.5,6 | C7.P$2 v22,6 | C8.P$2 v19.5,6 | C32.P$2 v4.5,40.5 | C31.P$2 v4.5,38 | R5.P$2 v4.5,35.5
  other vias: 29.66,20.41 26.32,23.02 42,13.5 22,13.5 25.84,32.23 23.43,32.23 11.08,27.72 11.08,26.95 10.82,28.86 10.82,29.87 26.41,28.04 16.92,29.87 16.92,28.86 15.81,27.68 15.81,26.92 9.84,27.68 9.84,26.92 7.61,25.69 8.76,25.69 7.61,24.74 8.76,24.74 13.58,25.69 14.85,25.69 13.58,24.8 14.85,24.8 14.22,25.25 4.14,60.27 4.14,61.16 4.14,62.04 5.03,60.27 5.03,61.16 5.03,62.04 1.6,58.87 2.49,58.87 3.38,58.87 1.6,57.98 2.49,57.98 3.38,57.98 31.14,32.92 31.02,34.45 32.03,33.56 32.92,31.78 33.81,32.67 33.81,34.45 32.79,35.08 38.51,56.8 39.27,56.8 40.03,56.8 40.8,56.8 38.51,55.53 39.27,55.53 40.03,55.53 40.8,55.53 38.51,54.39 39.27,54.39 40.03,54.39 40.8,54.39 8.12,25.18
  pour Bottom (rank 6, no thermals): 0.5,63.5 51.55,63.5 51.55,0.5 0.5,0.5
  pour Route3 (no thermals): 0.5,63.5 51.55,63.5 51.55,0.5 0.5,0.5
  pour Top (no thermals): 9.73,29.02 9.73,29.66 10.36,30.29 11.12,30.29 11.38,30.04 11.38,28.77 11.12,28.52 10.24,28.52
  pour Top (no thermals): 15.82,29.02 15.82,29.66 16.46,30.29 17.22,30.29 17.47,30.04 17.47,28.77 17.22,28.52 16.33,28.52
  pour Top (no thermals): 15,28.14 16.08,28.14 16.2,28.01 16.2,26.61 16.08,26.48 15,26.48
  pour Top (no thermals): 9.03,28.14 10.11,28.14 10.24,28.01 10.24,24.58 10.11,24.45 7.19,24.45 7.19,26.1 9.03,26.1
  pour Top (rank 6, no thermals): 0.46,63.57 0.46,57.22 16.59,57.22 17.6,56.2 17.6,51.12 18.11,50.61 25.35,50.61 25.35,46.55 26.62,46.55 26.62,54.3 31.57,54.3 31.57,63.57
  pour Top (rank 6, no thermals): 20.65,63.57 51.51,63.57 51.51,51.76 36.02,51.76 34.87,50.61 30.56,50.61 30.56,54.3 20.65,54.3
  pour Top (rank 6, no thermals): 0.46,63.44 0.46,53.03 3.25,53.03 3.25,63.44
  pour Top (no thermals): 15.06,28.14 15.06,25.98 13.28,25.98 13.28,24.45 15.82,24.45 15.82,26.36 16.33,26.36 16.33,28.14
N$1  (via drill 0.25)
  Top 0.33: v9.5,11.5 R6.P$2
  Bottom 0.33: R6.P$2 v9.5,11.5
N$2
  Top 1.016: FB3.1 11.5,12 12,11.5 13.45,11.5 C35.2 13.55,11.5 16.5,11.5 17.5,10.5 JP1.1
N$3
  Top 1.016: FB2.2 31.5,12 32,11.5 33.45,11.5 C34.2 36.33,11.55 37.38,10.5 JP2.1
N$6  (via drill 0.25)
  Top 0.33: R8.P$2 v30,11.5
  Bottom 0.33: v30,11.5 R8.P$2
N$7
  Top 0.254: U1.64 27.6,28.23 27.25,27.88 27.25,27.22 R7.P$2
N$10
  Top 0.406: R16.P$2 LED6.C
N$11
  Top 0.406: R18.P$2 LED7.C
N$12  (via drill 0.25)
  Top 0.254: U1.42 31.25,37.72 v31.57,38.04 | v6.3,47.19 LED7.A
  Bottom 0.254: v31.57,38.04 31.57,40.71 28.65,43.63 28.65,44.77 22.56,50.87 13.54,50.87 9.86,47.19 v6.3,47.19
N$13
  Top 0.254: 38.18,62.93 R13.P$2
  Top 0.61: LED5.C 38.18,62.93
N$14  (via drill 0.25)
  Top 0.254: U1.40 32.25,37.83 v32.46,38.04 | v6.3,48.96 LED6.A
  Bottom 0.254: v32.46,38.04 32.46,40.71 29.16,44.01 29.16,45.28 22.94,51.5 6.93,51.5 6.3,50.87 v6.3,48.96
N$15
  pour Top (no thermals): 41.6,54.42 43.13,54.42 43.13,54.93 43.64,54.93 43.64,53.53 43.13,53.53 43.13,54.04 41.6,54.04
OVERCUR1Z
  Top 0.254: U2.5 6.87,23.12 5.92,24.07 5.92,28.64 6.68,29.41 6.68,30.93 7.82,32.07 12.01,32.07 12.52,32.58 16.08,32.58 18.36,34.87 18.36,38.3 19.63,39.56 28.4,39.56 29.25,38.71 U1.46
OVERCUR2Z
  Top 0.254: U3.5 12.84,23.12 12.14,23.82 12.14,29.79 14.17,31.82 16.59,31.82 19,34.23 19,37.91 20.02,38.93 28.14,38.93 28.75,38.32 U1.47
P1_CAP_SSTX_N
  Bottom 0.203: JP1.8 20,12.16 19.17,13 19.17,14.22 C1.P$1
P1_CAP_SSTX_P
  Bottom 0.203: JP1.9 18,12.16 18.83,13 18.83,14.22 C2.P$1
P1_D_N  (via drill 0.25)
  Top 0.203: U1.2 28.75,27.59 28.66,27.5 28.66,25.57 29.66,24.57 29.66,22.5 v29.79,22.5
  Bottom 0.203: JP1.2 21,13.66 21.83,14.5 21.83,18.07 24.43,20.66 26.93,20.66 28.77,22.5 v29.79,22.5
P1_D_P  (via drill 0.25)
  Top 0.203: U1.1 28.25,27.59 28.34,27.5 28.34,25.43 29.34,24.43 29.34,22 v29.21,22
  Bottom 0.203: JP1.3 23,13.66 22.17,14.5 22.17,15.32 arc-90 22.42,15.58 22.48,15.58 arc90 22.74,15.84 22.74,15.97 arc90 22.48,16.23 22.42,16.23 arc-90 22.17,16.49 22.17,17.93 24.57,20.34 27.07,20.34 28.73,22 v29.21,22
P1_SSRX_N  (via drill 0.25)
  Top 0.203: U1.7 31.25,27.59 31.16,27.5 31.16,27 v31.29,27
  Bottom 0.203: v31.29,27 31.16,27 31.16,16.43 29.07,14.34 26.07,14.34 25.17,13.43 25.17,13 26,12.16 JP1.5
P1_SSRX_P  (via drill 0.25)
  Top 0.203: U1.6 30.75,27.59 30.84,27.5 30.84,27 v30.71,27
  Bottom 0.203: v30.71,27 30.84,27 30.84,16.57 28.93,14.66 25.93,14.66 24.83,13.57 24.83,13 24,12.16 JP1.6
P1_SSTX_N  (via drill 0.25)
  Top 0.203: U1.4 29.75,27.59 29.66,27.5 29.66,27 v29.79,27
  Bottom 0.203: v29.79,27 29.66,27 29.66,25.43 29.07,24.84 21.07,24.84 19.17,22.93 19.17,15.75 19.47,15.45 C1.P$2
P1_SSTX_P  (via drill 0.25)
  Top 0.203: U1.3 29.25,27.59 29.34,27.5 29.34,27 v29.21,27
  Bottom 0.203: v29.21,27 29.34,27 29.34,25.57 28.93,25.16 20.93,25.16 18.83,23.07 18.83,15.75 18.53,15.45 C2.P$2
P2_CAP_SSTX_N
  Bottom 0.203: JP2.8 40,12.16 39.16,13 39.16,14.22 C4.P$1
P2_CAP_SSTX_P
  Bottom 0.203: JP2.9 38,12.16 38.84,13 38.84,14.22 C3.P$1
P2_D_N  (via drill 0.25)
  Top 0.203: U1.10 32.75,27.59 32.66,27.5 32.66,25.57 34.07,24.16 35,24.16 v35,24.29
  Bottom 0.203: JP2.2 41,13.66 41.84,14.5 41.84,15.5 arc90 41.67,15.66 41.66,15.66 arc-90 41.5,15.83 41.5,16.17 arc-90 41.66,16.34 41.67,16.34 arc90 41.84,16.5 41.84,17.93 40.93,18.84 36.43,18.84 35.34,19.93 35.34,22.93 35,23.27 v35,24.29
P2_D_P  (via drill 0.25)
  Top 0.203: U1.9 32.25,27.59 32.34,27.5 32.34,25.43 33.93,23.84 35.5,23.84 v35.5,23.71
  Bottom 0.203: JP2.3 43,13.66 42.16,14.5 42.16,18.07 41.07,19.16 36.57,19.16 35.66,20.07 35.66,23.07 35.5,23.23 v35.5,23.71
P2_SSRX_N  (via drill 0.25)
  Top 0.203: U1.15 35.25,27.59 35.16,27.5 35.16,27 v35.29,27
  Bottom 0.203: v35.29,27 35.16,27 35.16,26.07 35.57,25.66 36.07,25.66 37.16,24.57 37.16,22.57 38.07,21.66 42.07,21.66 45.16,18.57 45.16,13 46,12.16 JP2.5
P2_SSRX_P  (via drill 0.25)
  Top 0.203: U1.14 34.75,27.59 34.84,27.5 34.84,27 v34.71,27
  Bottom 0.203: v34.71,27 34.84,27 34.84,25.93 35.43,25.34 35.93,25.34 36.84,24.43 36.84,22.43 37.93,21.34 41.93,21.34 44.84,18.43 44.84,13 44,12.16 JP2.6
P2_SSTX_N  (via drill 0.25)
  Top 0.203: U1.12 33.75,27.59 33.66,27.5 33.66,27 v33.79,27
  Bottom 0.203: v33.79,27 33.66,27 33.66,18.57 35.07,17.16 38.57,17.16 39.16,16.57 39.16,15.75 39.47,15.45 C4.P$2
P2_SSTX_P  (via drill 0.25)
  Top 0.203: U1.11 33.25,27.59 33.34,27.5 33.34,27 v33.21,27
  Bottom 0.203: v33.21,27 33.34,27 33.34,18.43 34.93,16.84 38.43,16.84 38.84,16.43 38.84,15.75 38.53,15.45 C3.P$2
PWRCTL1  (via drill 0.25)
  Top 0.254: U1.36 v34.25,38.03 v34.24,38.04 | v7.19,28.52 7.19,27.35 U2.4 | v34.16,39.56 30.43,39.56 28.91,41.09 v20.78,41.09 18.87,41.09 16.97,39.18 16.97,36.01 16.2,35.25 15.19,35.25 14.3,34.36 v14.3,33.22
  Bottom 0.254: v14.3,33.22 13.54,32.45 12.39,32.45 11.38,31.44 7.95,31.44 7.19,30.67 v7.19,28.52 | v34.24,38.04 34.24,39.49 v34.16,39.56
  Bottom 0.305: R15.P$1 v20.78,41.09
PWRCTL2  (via drill 0.25)
  Top 0.254: 13.19,27.35 U3.4 13.16,27.38 v13.16,28.52 | v15.44,33.22 15.48,33.25 15.48,34.39 15.82,34.74 16.59,34.74 17.6,35.75 17.6,38.55 19.38,40.33 v21.92,40.33 28.65,40.33 30.18,38.8 34.37,38.8 34.75,38.42 U1.35
  Bottom 0.254: v13.16,28.52 13.16,30.8 14.05,31.69 14.55,31.69 15.44,32.58 v15.44,33.22
  Bottom 0.305: R17.P$1 v21.92,40.33
US_CAP_SSTX_N
  Bottom 0.203: C29.P$1 11.96,42 11.75,41.79 10.92,41.79 JP5.5
US_CAP_SSTX_P
  Bottom 0.203: C30.P$1 11.96,41.25 11.75,41.46 10.92,41.46 JP5.6
US_D_N  (via drill 0.25)
  Top 0.203: U1.54 27.08,33.75 27,33.83 25.89,33.83 25.44,34.29 25.44,34.99 v25.31,34.99
  Bottom 0.203: JP5.2 8.21,39.58 7.29,40.5 7.29,41 arc-90 7.45,41.16 7.5,41.16 arc90 7.67,41.33 7.67,41.66 arc90 7.5,41.83 7.45,41.83 arc-90 7.29,41.99 7.29,43.06 9.07,44.83 23.91,44.83 25.44,43.31 25.44,34.99 v25.31,34.99
US_D_P  (via drill 0.25)
  Top 0.203: U1.53 27.08,34.25 27,34.17 26.03,34.17 25.77,34.43 25.77,34.99 v25.89,34.99
  Bottom 0.203: JP5.3 6.21,39.75 6.96,40.5 6.96,43.19 8.93,45.17 24.05,45.17 25.77,43.44 25.77,34.99 v25.89,34.99
US_SSRX_N  (via drill 0.25)
  Top 0.203: U1.59 27.08,31.25 27,31.33 26.5,31.33 v26.5,31.21
  Bottom 0.203: JP5.9 11.17,33.5 11.87,34.21 19.56,34.21 22.43,31.33 26.5,31.33 v26.5,31.21
US_SSRX_P  (via drill 0.25)
  Top 0.203: U1.58 27.08,31.75 27,31.67 26.5,31.67 v26.5,31.79
  Bottom 0.203: JP5.8 11.16,35.25 11.87,34.54 19.69,34.54 22.57,31.67 26.5,31.67 v26.5,31.79
US_SSTX_N  (via drill 0.25)
  Top 0.203: U1.56 27.08,32.75 27,32.83 26.5,32.83 v26.5,32.71
  Bottom 0.203: C30.P$2 13.04,41.25 13.25,41.46 17.81,41.46 21.33,37.93 21.33,35.93 24.43,32.83 26.5,32.83 v26.5,32.71
US_SSTX_P  (via drill 0.25)
  Top 0.203: U1.55 27.08,33.25 27,33.17 26.5,33.17 v26.5,33.29
  Bottom 0.203: C29.P$2 13.04,42 13.25,41.79 17.94,41.79 21.67,38.07 21.67,36.07 24.57,33.17 26.5,33.17 v26.5,33.29
US_VBUS  (via drill 0.25)
  Top 0.254: U1.48 28.25,37.75 v28,38
  Top 0.61: JP5.1 13.01,36.75 13.16,36.9 13.03,36.9 C33.1 14.87,36.83 15.19,37.15 15.19,40.07 17.73,42.61 27.22,42.61 v28,41.83
  Bottom 0.61: v28,38 v28,41.83
VDD11  (via drill 0.25, 0.33)
  Top 0.127: C68.1 38.81,32.2
  Top 0.229: U1.57 v28.25,32.25 | U1.31 v35.75,35.75 | U1.28 v35.75,34.25 | U1.21 v35.75,30.75 | v34.25,28.75 U1.13 | U1.8 v31.75,28.75 | U1.5 v30.25,28.75
  Top 0.254: U1.51 28.15,35.25 28.27,35.37 28.27,35.74 v28.38,35.88
  Top 1.016: 38.81,32.2 v38.81,31.82 v38.81,31.06
  Bottom 0.254: C21.P$1 v35.75,34.25 | C20.P$1 v35.75,30.75 | C19.P$1 v34.25,28.75 | C22.P$1 28.55,35.73 28.52,35.75
  Bottom 0.305: C18.P$1 C60.P$1 32.21,29.57 32.21,29.02 31.93,28.75 v31.75,28.75 | C22.P$1 C57.P$1 | C24.P$1 C56.P$1 28.54,32.25 v28.25,32.25 | C21.P$1 35.45,34.25 C59.P$1 | C20.P$1 C61.P$1 | C19.P$1 C63.P$1 | 28.52,35.75 v28.38,35.88 | v30.25,28.75 30.25,28.84 30.43,29.02 30.43,29.57 C58.P$1 C17.P$1 | v35.75,35.75 35.42,36.08 C62.P$1 C23.P$1
  other vias: 36.65,46.04 37.54,46.04 38.43,46.04 39.32,46.04 37.1,46.68 37.99,46.68 38.87,46.68
  pour Route2 (isolate 0.305, no thermals): 51.51,48.07 34.24,48.07 34.24,44.14 37.54,44.14 37.54,37.15 31.7,37.15 31.7,39.56 27.25,39.56 27.25,35.5 29.03,35.5 29.03,33.6 27.76,33.6 27.76,30.17 29.16,30.17 29.16,28.26 51.51,28.26
  pour Top (no thermals): 40.72,48.07 40.72,46.42 39.7,45.41 36.27,45.41 35.25,46.42 35.25,48.07
VDD33  (via drill 0.25, 0.33)
  Top 0.229: U1.52 28.12,34.75 v28.25,34.62 | U1.63 v28.25,29.25 | U1.16 35.75,27.75 v36.25,27.25 C25.P$1 | C27.P$1 v35.5,38.25
  Top 0.254: U1.34 35.25,38.01 v35.5,38.25
  Top 0.305: C25.P$1 C65.P$1 | C27.P$1 C67.P$1
  Top 0.61: C69.1 24.65,36.08 v24.59,36.01 v23.83,36.01
  Bottom 0.229: 28.55,34.42 28.5,34.5
  Bottom 0.254: R17.P$2 21.92,43.12 v21.28,43.76 20.78,43.25 R15.P$2
  Bottom 0.305: C64.P$1 C28.P$1 28.42,29.25 v28.25,29.25 | 28.55,34.42 C26.P$1 | C26.P$1 C66.P$1 | C26.P$1 28.5,34.37 v28.25,34.62
  other vias: 30.81,45.66 30.81,44.9 31.57,44.9 32.33,44.9 33.1,44.9 33.1,45.66
  pour Top (no thermals): 31.83,46.04 30.56,46.04 30.18,45.66 30.18,44.39 30.56,44.01 33.35,44.01 33.73,44.39 33.73,45.66 33.35,46.04
  pour Route2 (isolate 0.305, no thermals): 33.73,46.17 18.36,46.17 18.36,18.99 36.65,18.99 36.65,27.75 28.65,27.75 28.65,29.66 27.25,29.66 27.25,34.1 28.52,34.1 28.52,34.99 26.75,34.99 26.75,40.07 32.21,40.07 32.21,37.66 37.03,37.66 37.03,43.63 33.73,43.63
(copper drawn outside any net)
  shapes: Bottom area x2

### Text on the board
tPlace: TravisE | 2A Load MAX | (Per Port. 8A Total) | Port 2 | BATT Charger | Port 1 | BATT Charger
bPlace: USB 3.0 4-Port Hub | V1.0.0.0 | Power Supply: 5V 5A | BATT Charger: Port 1 & Port 2
Notes: Notes | -- 4-Layer PCB | -- Top: Signal Layer 1 NO GND FILL | -- Route2: Power | -- Route3: GND NO SPLITS | -- Bottom: High-Speed Signals (GND plane referenced) | -- Differential signals 90 Ohm Diff Impedance | -- 8 mil traces | -- 5 mil spacing | -- OshPark Board Stackup | -- If printing elsewhere, traces and spacing / may need adjusting